# Altium schematic sheet Prismino_Copter.SchDoc
size A4
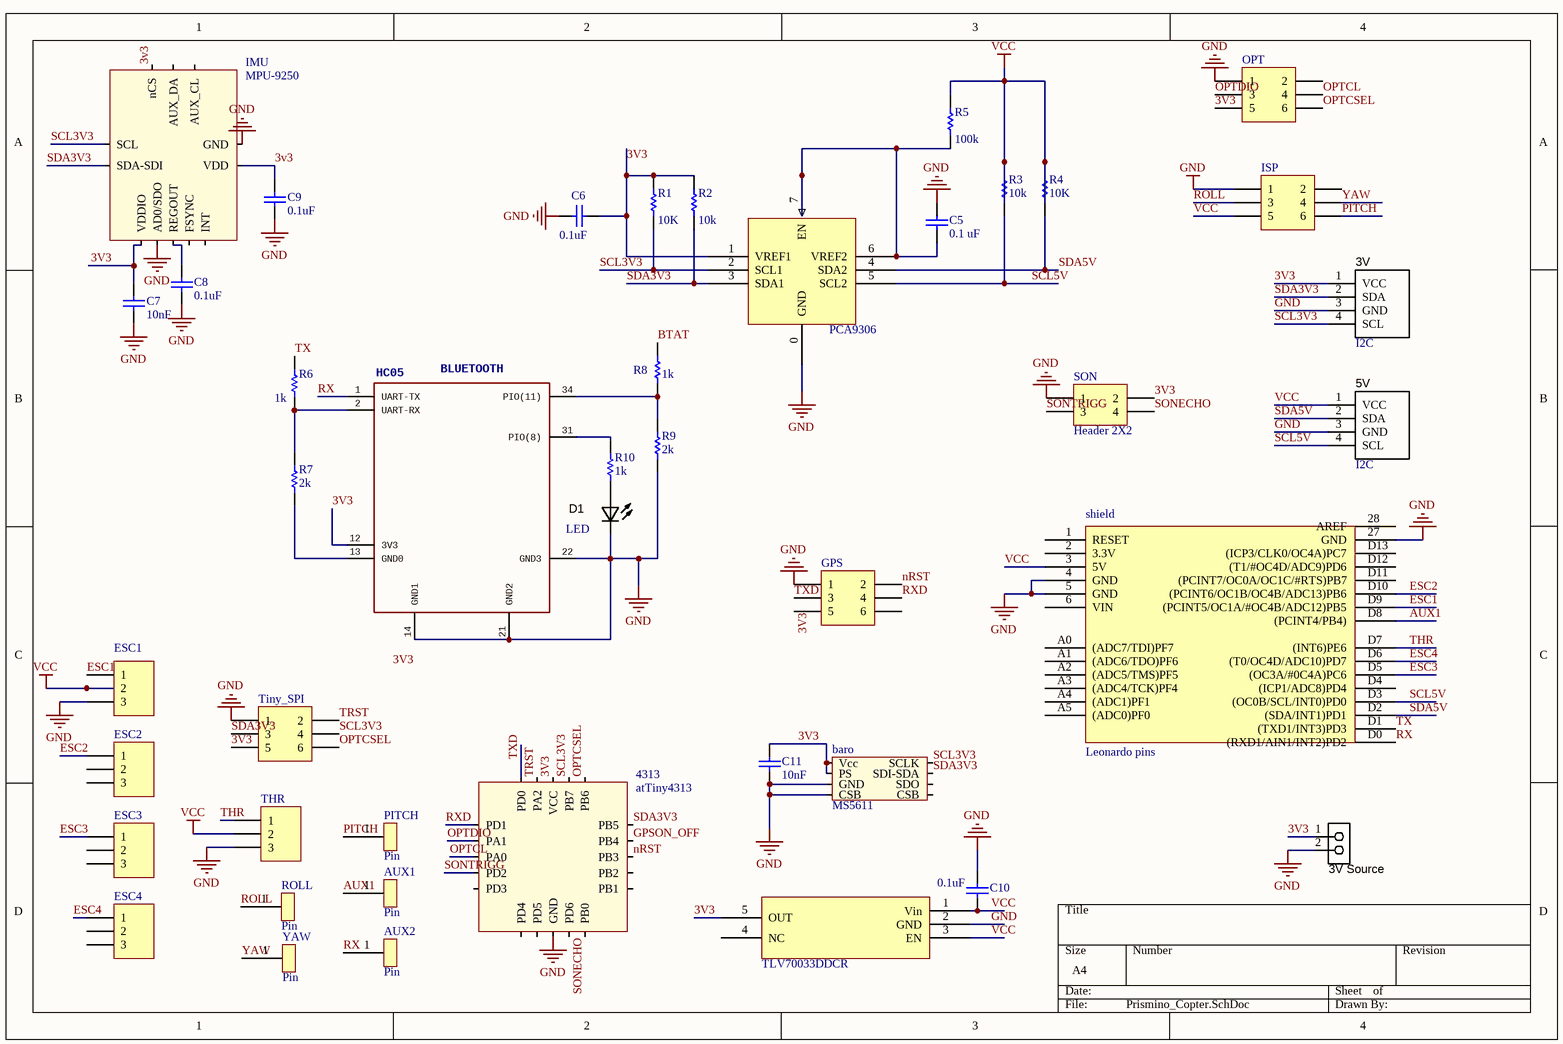
[diagram p0: Prismino_Copter.SchDoc]

## Parts
3V  I2C  [TYCO/215079-4]
3V_Source  Header 2  [HEADER1x2]  (value not drawn)
5V  I2C  [TYCO/215079-4]
4313  atTiny4313  [QFN45P300X300X100_HS-21N]
AUX1  Pin  [Pin]
AUX2  Pin  [Pin]
baro  MS5611  [MS5611]
C5  value 0.1 uF  [MELF-R2012-0805]  (hidden comment: C0805)
C6  value 0.1uF  [MELF-R2012-0805]  (hidden comment: C0805)
C7  value 10nF  [MELF-R2012-0805]  (hidden comment: capa)
C8  value 0.1uF  [MELF-R2012-0805]  (hidden comment: capa)
C9  value 0.1uF  [MELF-R2012-0805]  (hidden comment: capa)
C10  value 0.1uF  [MELF-R2012-0805]  (hidden comment: C0805)
C11  value 10nF  [MELF-R2012-0805]  (hidden comment: capa)
D1  LED  [LED-2012[0805]]
ESC1  Header 3  [HDR1X3]  (value not drawn)
ESC2  Header 3  [HDR1X3]  (value not drawn)
ESC3  Header 3  [HDR1X3]  (value not drawn)
ESC4  Header 3  [HDR1X3]  (value not drawn)
GPS  Header 3X2  [HDR2X3]  (value not drawn)
HC05  BLUETOOTH  [BLUETOOTH]
IMU  MPU-9250  [MPU-9250 2]
ISP  Header 3X2  [HDR2X3]  (value not drawn)
OPT  Header 3X2  [HDR2X3]  (value not drawn)
PCA9306  PCA9306  [TSOP65P490X110-8N]
PITCH  Pin  [Pin]
R1  value 10K  [MELF-R2012-0805]  (hidden comment: Res1)
R2  value 10k  [MELF-R2012-0805]  (hidden comment: Res1)
R3  value 10k  [MELF-R2012-0805]  (hidden comment: Res1)
R4  value 10K  [MELF-R2012-0805]  (hidden comment: Res1)
R5  value 100k  [MELF-R2012-0805]  (hidden comment: Res1)
R6  value 1k  [MELF-R2012-0805]  (hidden comment: resistor)
R7  value 2k  [MELF-R2012-0805]  (hidden comment: resistor)
R8  value 1k  [MELF-R2012-0805]  (hidden comment: resistor)
R9  value 2k  [MELF-R2012-0805]  (hidden comment: resistor)
R10  value 1k  [MELF-R2012-0805]  (hidden comment: resistor)
ROLL  Pin  [Pin]
shield  Leonardo pins  [Leonardo pins]
SON  Header 2X2  [HDR2X2]
THR  Header 3  [HDR1X3]  (value not drawn)
Tiny_SPI  Header 3X2  [HDR2X3]  (value not drawn)
TLV70033DDCR  TLV70033DDCR  [TLV70033DDCR]
YAW  Pin  [Pin]

## Nets
GND: 3V.3(GND) 3V_Source.2 5V.3(GND) 4313.8(GND) baro.3(GND) baro.4(CSB) C5.2 C6.1 C7.1 C8.1 C9.1 C10.2 C11.1 D1.K ESC1.3 GPS.1 HC05.14(GND1) HC05.21(GND2) HC05.22(GND3) IMU.9(AD0/SDO) IMU.18(GND) ISP.1 OPT.1 PCA9306.0(GND) R9.1 shield.4(GND) shield.5(GND) shield.27(GND) SON.1 THR.3 Tiny_SPI.1 TLV70033DDCR.2(GND)
VCC: 5V.1(VCC) C10.1 ESC1.2 ISP.5 R3.2 R4.2 R5.2 shield.3(5V) THR.2 TLV70033DDCR.1(Vin) TLV70033DDCR.3(EN)
3V3: 3V.1(VCC) 3V_Source.1 4313.18(VCC) baro.1(Vcc) baro.2(PS) C6.2 C7.2 C9.2 C11.2 GPS.5 HC05.12(3V3) IMU.8(VDDIO) IMU.13(VDD) IMU.22(nCS) OPT.5 PCA9306.1(VREF1) R1.2 R2.2 SON.2 Tiny_SPI.5 TLV70033DDCR.5(OUT)
AUX1: AUX1.1 shield.D8((PCINT4/PB4))
BTAT: R8.2
ESC1: ESC1.1 shield.D9((PCINT5/OC1A/#OC4B/ADC12)PB5)
ESC2: ESC2.1 shield.D10((PCINT6/OC1B/OC4B/ADC13)PB6)
ESC3: ESC3.1 shield.D5((OC3A/#0C4A)PC6)
ESC4: ESC4.1 shield.D6((T0/OC4D/ADC10)PD7)
GPSON_OFF: 4313.14(PB4)
nRST: 4313.13(PB3) GPS.2
OPTCL: 4313.3(PA0) OPT.4
OPTCSEL: 4313.16(PB6) OPT.6 Tiny_SPI.6
OPTDIO: 4313.2(PA1) OPT.3
PITCH: ISP.6 PITCH.1
ROLL: ISP.3 ROLL.1
RX: AUX2.1 HC05.1(UART-TX) shield.D0((RXD1/AIN1/INT2)PD2)
RXD: 4313.1(PD1) GPS.4
SCL3V3: 3V.4(SCL) 4313.17(PB7) baro.8(SCLK) IMU.23(SCL) PCA9306.2(SCL1) R1.1 Tiny_SPI.4
SCL5V: 5V.4(SCL) PCA9306.5(SCL2) R3.1 shield.D3((OC0B/SCL/INT0)PD0)
SDA3V3: 3V.2(SDA) 4313.15(PB5) baro.7(SDI-SDA) IMU.24(SDA-SDI) PCA9306.3(SDA1) R2.1 Tiny_SPI.3
SDA5V: 5V.2(SDA) PCA9306.4(SDA2) R4.1 shield.D2((SDA/INT1)PD1)
SONECHO: 4313.9(PD6) SON.4
SONTRIGG: 4313.4(PD2) SON.3
THR: shield.D7((INT6)PE6) THR.1
TRST: 4313.19(PA2) Tiny_SPI.2
TX: R6.2 shield.D1((TXD1/INT3)PD3)
TXD: 4313.20(PD0) GPS.3
YAW: ISP.4 YAW.1
NetC5_1: C5.1 PCA9306.6(VREF2) PCA9306.7(EN) R5.1
NetC8_2: C8.2 IMU.10(REGOUT)
NetD1_A: D1.A R10.1
NetHC05_2: HC05.2(UART-RX) R6.1 R7.2
NetHC05_13: HC05.13(GND0) R7.1
NetHC05_31: HC05.31(PIO(8)) R10.2
NetHC05_34: HC05.34(PIO(11)) R8.1 R9.2

Not connected (* = marked no-connect by the designer): 4313 5(PD3) 6(PD4) 7(PD5) 10(PB0) 11(PB1) 12(PB2); baro 5(CSB) 6(SDO); ESC2 2 3; ESC3 2 3; ESC4 2 3; GPS 6; IMU 7(AUX_CL) 11(FSYNC) 12(INT) 21(AUX_DA); ISP 2; OPT 2; shield 1(RESET) 2(3.3V) 6(VIN) 28(AREF) A0((ADC7/TDI)PF7) A1((ADC6/TDO)PF6) A2((ADC5/TMS)PF5) A3((ADC4/TCK)PF4) A4((ADC1)PF1) A5((ADC0)PF0) D4((ICP1/ADC8)PD4) D11((PCINT7/OC0A/OC1C/#RTS)PB7) D12((T1/#OC4D/ADC9)PD6) D13((ICP3/CLK0/OC4A)PC7); TLV70033DDCR 4(NC)

## Notes on the sheet
- Labels drawn without touching a wire or pin: 3V3

## Library data of the parts
3V 5V = Micromatch-I2C: Micromatch I2C Connector
3V_Source = Header 2: Header, 2-Pin; LatestRevisionDate: 17-Jul-2002; LatestRevisionNote: Re-released for DXP Platform.; Publisher: Altium Limited
C5 C6 C10 = C0805: Ceramic Chip Capacitor - Standard; Note: Footprint corresponds to dimensions for bulk cassette packaging. This case size has tightened tolerances.; Published: 17-Jul-2002; LatestRevisionDate: 19-Mar-2004; LatestRevisionNote: Silkscreen size reduced.; DatasheetDocument: Mar-2001; PackageDocument: Mar-2001; PackageReference: 0805; Publisher: Altium Limited; Code_JEITA: 0805; Code_IPC: 2012[0805]; ComponentLink1Description: Manufacturer Link; ComponentLink1URL: http://www.kemet.com/; ComponentLink2Description: Datasheet; ComponentLink2URL: http://www.kemet.com/kemet/web/homepage/kechome.nsf/vapubfilesname/F3102TA.pdf/$file/F3102TA.pdf
C7-C9 C11 = capacitor: Note: Footprint corresponds to dimensions for bulk cassette packaging. This case size has tightened tolerances.; Published: 17-Jul-2002; LatestRevisionDate: 19-Mar-2004; LatestRevisionNote: Silkscreen size reduced.; DatasheetDocument: Mar-2001; PackageDocument: Mar-2001; PackageReference: 0805; Publisher: Altium Limited; Code_JEITA: 0805; Code_IPC: 2012[0805]; ComponentLink1Description: Manufacturer Link; ComponentLink1URL: http://www.kemet.com/; ComponentLink2Description: Datasheet; ComponentLink2URL: http://www.kemet.com/kemet/web/homepage/kechome.nsf/vapubfilesname/F3102TA.pdf/$file/F3102TA.pdf
ESC1-ESC4 THR = Header 3: Header, 3-Pin; LatestRevisionDate: 17-Jul-2002; LatestRevisionNote: Re-released for DXP Platform.; Publisher: Altium Limited
GPS ISP OPT Tiny_SPI = Header 3X2: Header, 3-Pin, Dual row; LatestRevisionDate: 17-Jul-2002; LatestRevisionNote: Re-released for DXP Platform.; Publisher: Altium Limited
PCA9306 = Component_1_1: I²C shifting voltage; pin to pad: 0>1 1>2 2>3 3>4 4>5 5>6 6>7 7>8
R1-R5 = Res1: Resistor; Published: 8-Jun-2000; LatestRevisionDate: 17-Jul-2002; LatestRevisionNote: Re-released for DXP Platform.; PackageReference: AXIAL-0.3; Publisher: Altium Limited; PackageDescription: Axial Device, Thru-Hole; 2 Leads; 0.3 in Pin Spacing
SON = Header 2X2: Header, 2-Pin, Dual row; LatestRevisionDate: 17-Jul-2002; LatestRevisionNote: Re-released for DXP Platform.; Publisher: Altium Limited
TLV70033DDCR = TLV700xx: Header, 2-Pin; LatestRevisionDate: 17-Jul-2002; LatestRevisionNote: Re-released for DXP Platform.; Publisher: Altium Limited
D1 = LED: Published: 8-Jun-2000; LatestRevisionDate: 08-Jul-2005; LatestRevisionNote: Mech Layer 1 removed.; PackageReference: LED-0; Publisher: Altium Limited
R6-R10 = resistor: Published: 8-Jun-2000; LatestRevisionDate: 17-Jul-2002; LatestRevisionNote: Re-released for DXP Platform.; PackageReference: AXIAL-0.3; Publisher: Altium Limited; PackageDescription: Axial Device, Thru-Hole; 2 Leads; 0.3 in Pin Spacing